# EAGLE design wemos_temp (EAGLE 8.1.1)
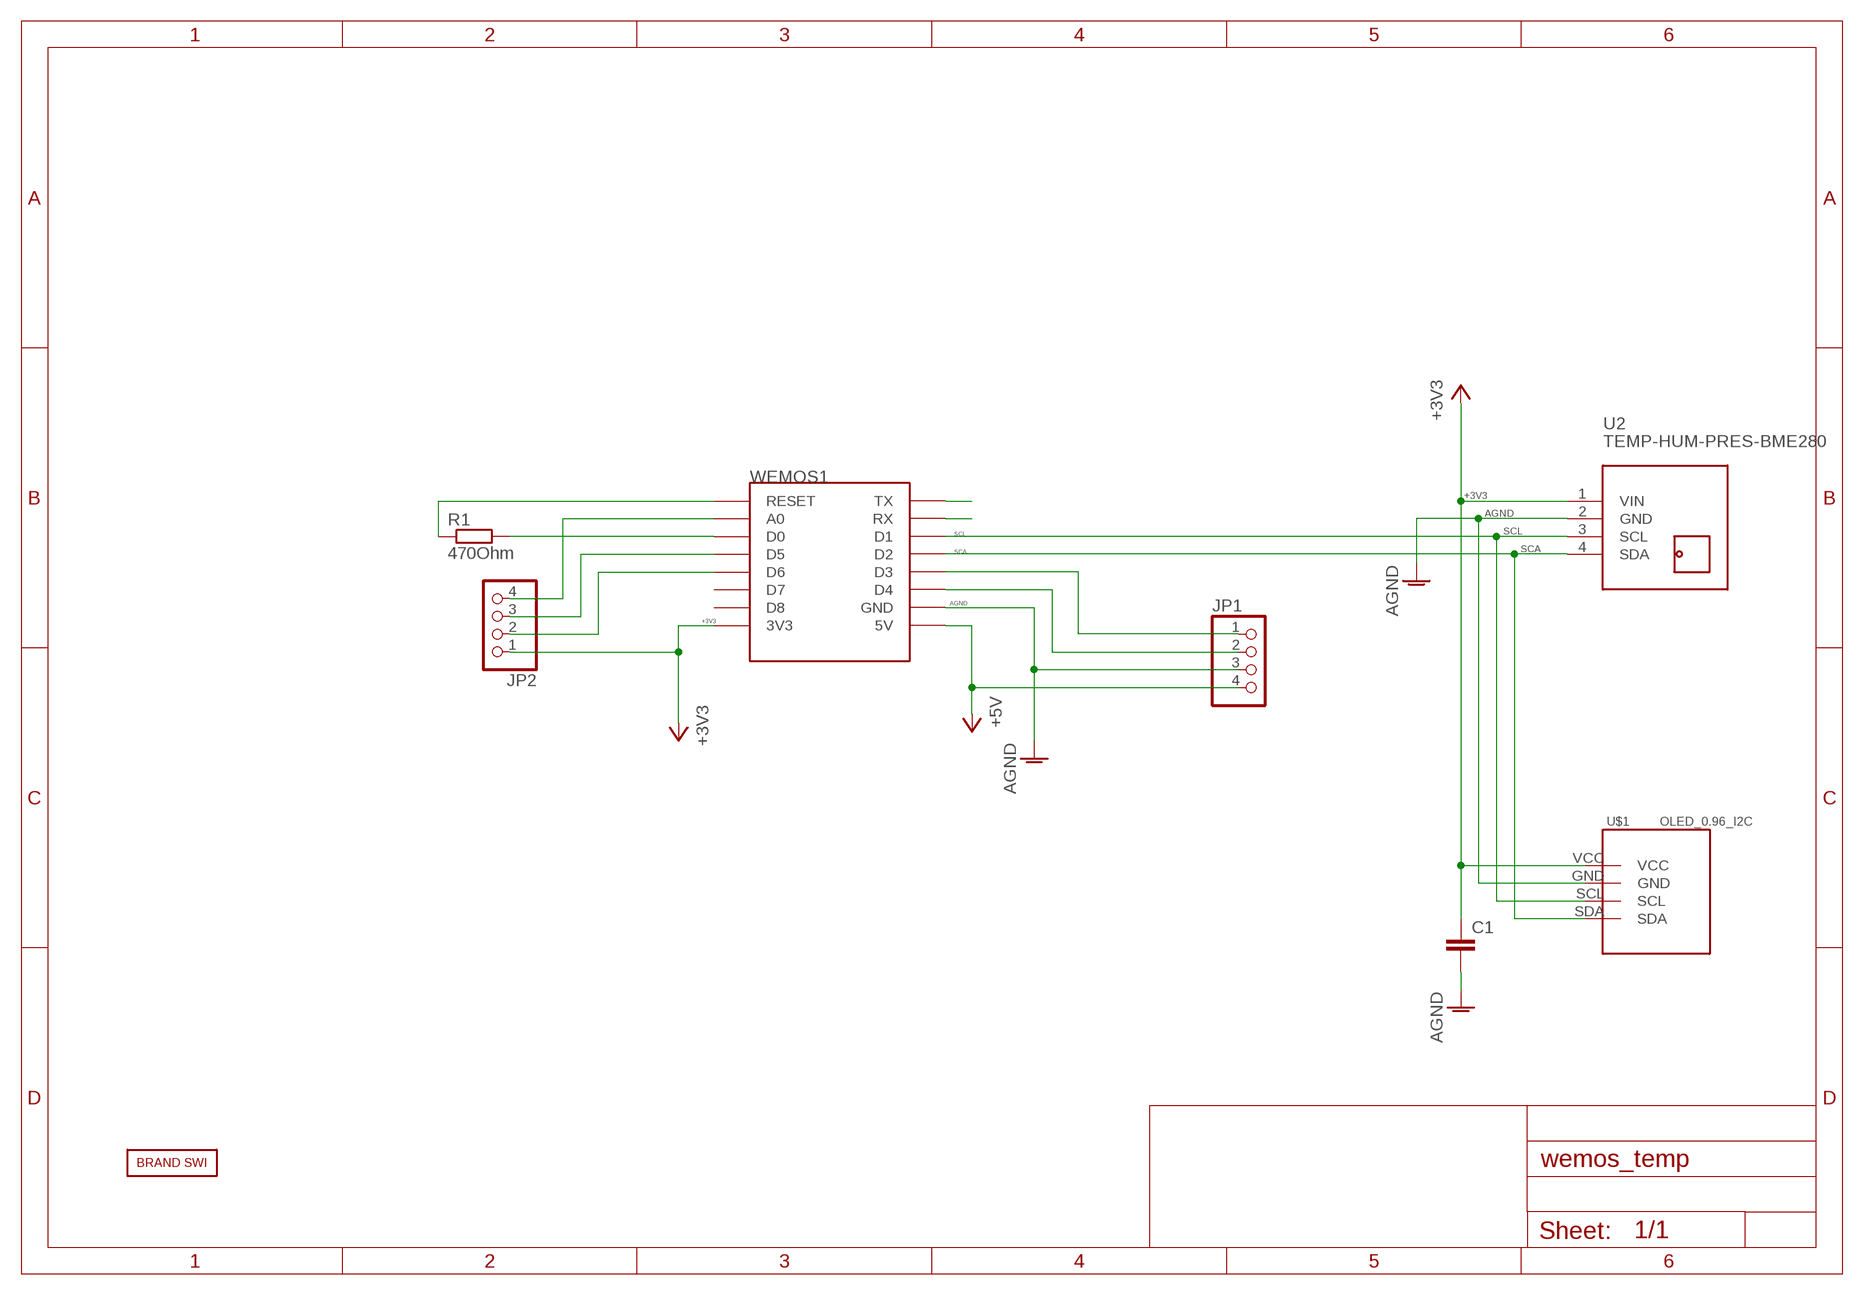
[diagram p0: schematic, sheet 1]

## Parts
C1  C-EUC1210  [C1210]
JP1  PINHD-1X4  [1X04]
JP2  PINHD-1X4  [1X04]
R1  470Ohm  R-EU_R0805  [R0805]
U2  TEMP-HUM-PRES-BME280  [TEMP-HUM-PRES-BME280]
U$1  OLED_0.96_I2C  [OLED_0.96_I2C]
U$2  BRAND_SWI5X7  [BRAND_SWI_5X7]
WEMOS1  WEMOS-D1-MINI  [WEMOS-D1-MINI]

## Nets
+3V3: C1.1 JP2.1 U2.1(VIN) U$1.VCC WEMOS1.3V3
+5V: JP1.4 WEMOS1.5V
AGND: C1.2 JP1.3 U2.2(GND) U$1.GND WEMOS1.GND
D4: JP1.2 WEMOS1.D4
N$1: R1.1 WEMOS1.RESET
N$2: R1.2 WEMOS1.D0
N$3: JP1.1 WEMOS1.D3
N$4: JP2.4 WEMOS1.A0
N$5: JP2.3 WEMOS1.D5
N$6: JP2.2 WEMOS1.D6
RX: WEMOS1.RX
SCA: U2.4(SDA) U$1.SDA WEMOS1.D2
SCL: U2.3(SCL) U$1.SCL WEMOS1.D1
TX: WEMOS1.TX
Unconnected: WEMOS1.D7 WEMOS1.D8

## Library data of the parts
C1 = rcl:C-EU: CAPACITOR, European symbol
JP1 JP2 = pinhead:PINHD-1X4: PIN HEADER
R1 = rcl:R-EU_: RESISTOR, European symbol
U2 = diy-modules:TEMP-HUM-PRES-BME280: Digital Humidity-Temperature-Pressure Sensor based on BME280 device More information about BME280 device is available here: https://www.bosch-sensortec.com/bst/products/all_products/bme280 Click here to find device on ebay.com <http://www.ebay.com/sch/bme280+breakout>
U$1 = SWI_COMMONS:OLED_0.96_I2C
U$2 = BRAND_SWI:BRAND_SWI
WEMOS1 = SWI_COMMONS:WEMOS-D1-MINI: WeMos.cc D1 mini ESP8266 module

## Board
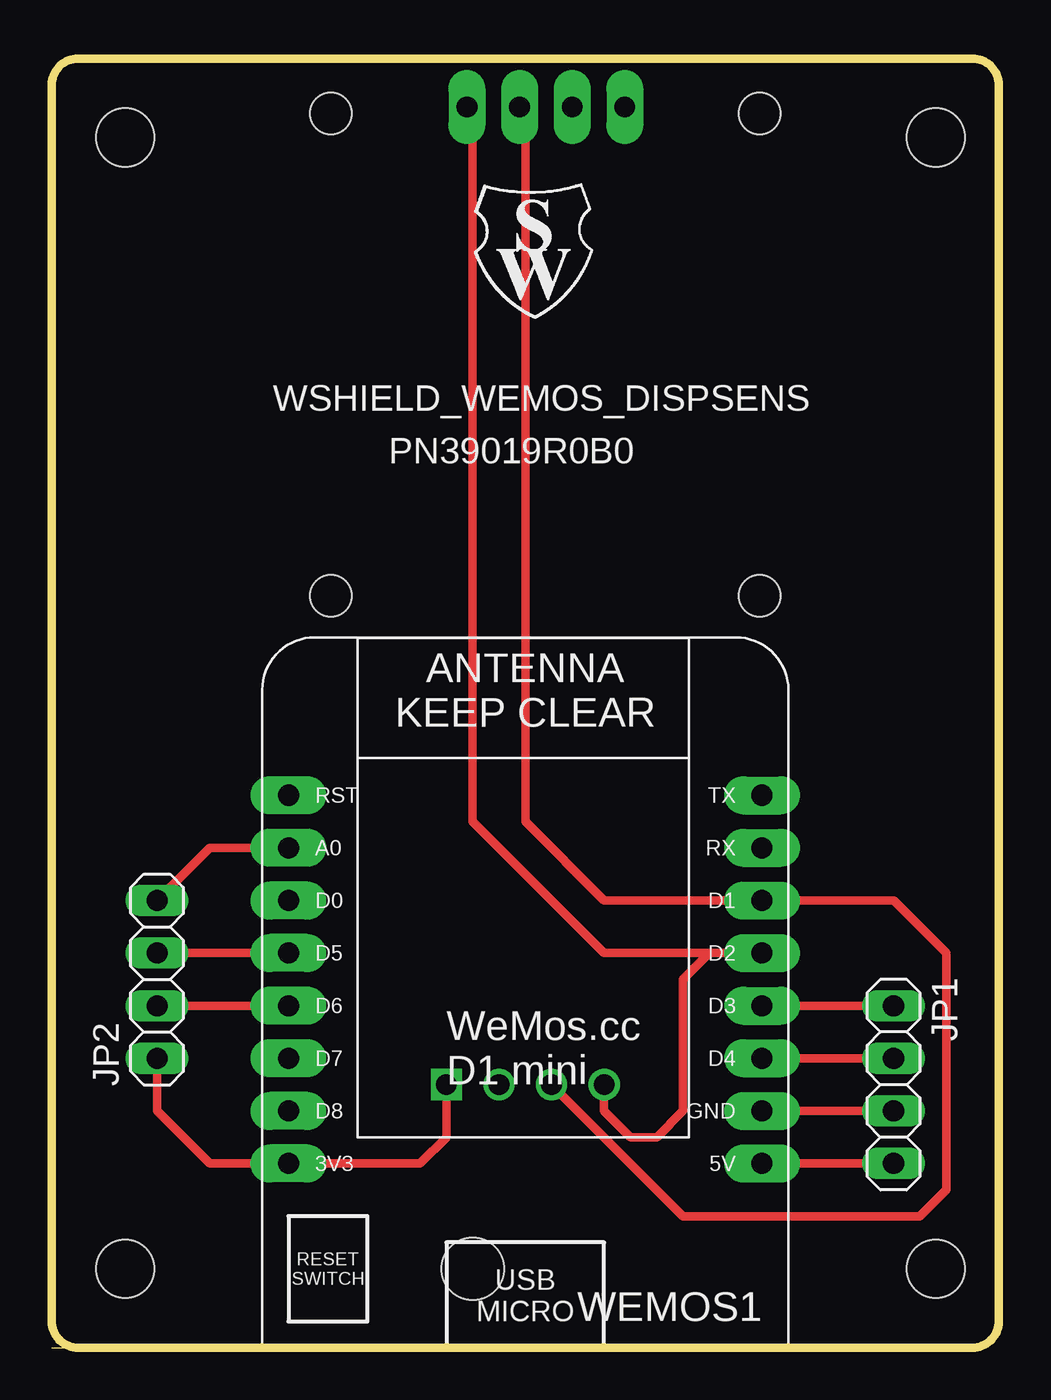
[diagram p1: board, top side]
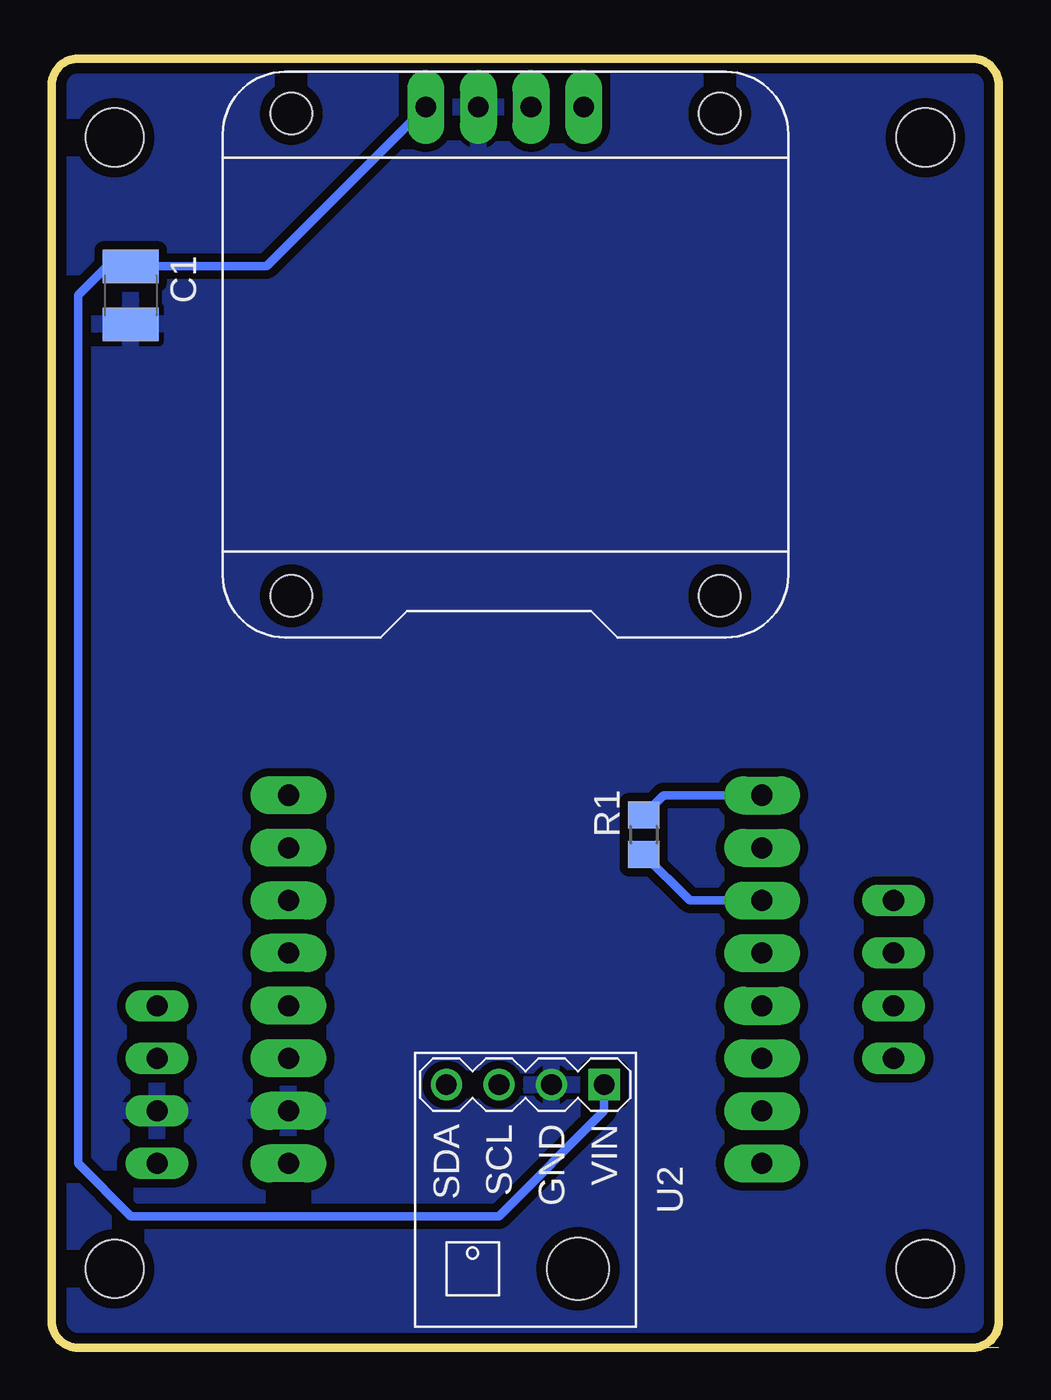
[diagram p2: board, bottom side, seen from below]

Size 45.72 x 62.23 mm. Coordinates in mm from the lower left corner, seen from the top.
Outline: 0,0 1.27,0
Outline: 1.27,0 2.03,0
Outline: 28.45,0 31.42,0
Outline: 1.27,0 44.45,0 arc90 45.72,1.27 45.72,60.96 arc90 44.45,62.23 1.27,62.23 arc90 0,60.96 0,1.27 arc90 1.27,0
Copper layers (1*16): Top 0.035mm / dielectric 1.6mm / Bottom 0.035mm
Design rules "Elecrow_2-layer_PCB_eagle_rule *": minimum track width 12mil, minimum drill 12mil, track to track 6mil, track to pad 6mil, pad to pad 6mil, via to via 8mil, smd to smd 0mil, copper to edge 20mil, drill to drill 10mil, minimum pad ring 6mil, minimum via ring 6mil, stop-mask expansion 0mil, vias tented up to drill 100mil, thermal gap 10mil
Holes 2.8 mm at 3.54,58.42 42.68,58.42 42.68,3.81 3.54,3.81

### Footprints (pad centres in the part's own frame; a part is rotated, then mirrored left to right if it is on the bottom)
C1210 = smd 1.6 x 2.7: 1 -1.4,0; 2 1.4,0
1X04 = drill 1.016 long: 1 -3.81,0; 2 -1.27,0; 3 1.27,0; 4 3.81,0
R0805 = smd 1.3 x 1.5: 1 -0.95,0; 2 0.95,0
TEMP-HUM-PRES-BME280 = drill 1 square: 1 -5.08,3.81 | drill 1: 2 -5.08,1.27; 3 -5.08,-1.27; 4 -5.08,-3.81 | hole 3: 3.81,2.54
OLED_0.96_I2C = drill 1 pad 1.778 long: GND -1.63,11.63; SCL 0.91,11.63; SDA 3.45,11.63; VCC -4.17,11.63 | hole 2: -10.67,-11.97; 10.03,-11.97; 10.03,11.33; -10.67,11.33
WEMOS-D1-MINI = drill 1.016 pad 1.829 long: 3V3 -10.16,-10.16; 5V 12.7,-10.16; A0 -10.16,5.08; D0 -10.16,2.54; D1 12.7,2.54; D2 12.7,0; D3 12.7,-2.54; D4 12.7,-5.08; D5 -10.16,0; D6 -10.16,-2.54; D7 -10.16,-5.08; D8 -10.16,-7.62; GND 12.7,-7.62; RESET -10.16,7.62; RX 12.7,5.08; TX 12.7,7.62

### Placement (x,y rotation side)
C1  41.91,50.8 270 bottom
JP1  40.64,12.7 270 top
JP2  5.08,17.78 90 top
R1  17.14,24.77 270 bottom
U2  22.86,7.62 270 bottom
U$1  23.5,48.26 0 bottom
U$2  20.19,49.53 0 top
WEMOS1  21.59,19.05 0 top

### Tracks (layer width: path | path; a pad name or v marks a point on that pad's centre or on a via)
+3V3
  Top 0.406: JP2.1 5.08,11.43 7.62,8.89 WEMOS1.3V3 17.78,8.89 19.05,10.16 U2.1
  Bottom 0.406: C1.1 35.35,52.2 | 35.35,52.2 U$1.VCC | 35.35,52.2 43.05,52.2 44.45,50.8 44.45,8.89 41.91,6.35 24.13,6.35 19.05,11.43 U2.1
+5V
  Top 0.406: WEMOS1.5V JP1.4
AGND
  Top 0.406: WEMOS1.GND JP1.3
  pour Bottom (isolate 0.406): 0,59.69 arc-90 2.54,62.23 3.81,62.23 43.18,62.23 arc-90 45.72,59.69 45.72,2.54 arc-90 43.18,0 41.91,0 1.27,0 arc-90 0,1.27 0,2.54
D4
  Top 0.406: WEMOS1.D4 JP1.2
N$1
  Bottom 0.406: WEMOS1.RESET 16.19,26.67 R1.1
N$2
  Bottom 0.406: WEMOS1.D0 14.92,21.59 R1.2
N$3
  Top 0.406: WEMOS1.D3 JP1.1
N$4
  Top 0.406: WEMOS1.A0 7.62,24.13 JP2.4
N$5
  Top 0.406: WEMOS1.D5 JP2.3
N$6
  Top 0.406: WEMOS1.D6 JP2.2
SCA
  Top 0.406: U2.4 26.67,11.43 27.94,10.16 29.21,10.16 30.48,11.43 30.48,17.78 31.75,19.05 | 31.75,19.05 WEMOS1.D2 | 31.75,19.05 26.67,19.05 20.32,25.4 20.32,59.62 U$1.SDA
SCL
  Top 0.406: U2.3 30.48,6.35 41.91,6.35 43.18,7.62 43.18,19.05 40.64,21.59 WEMOS1.D1 26.67,21.59 22.86,25.4 22.86,59.62 U$1.SCL

### Text on the board
tNames: WSHIELD_WEMOS_DISPSENS | PN39019R0B0